# Altium schematic sheet SD_Card.SchDoc
size A4; SheetNumber: 3; SheetTotal: 7
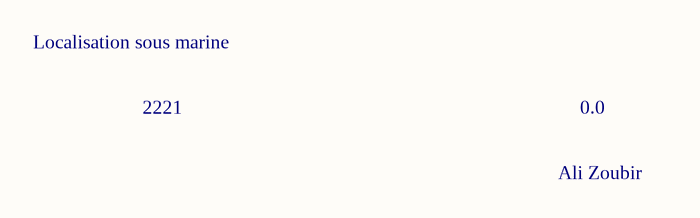
[diagram p0: SD_Card.SchDoc]

## Notes on the sheet
- Localisation sous marine
- 2221
- 0.0
- Ali Zoubir